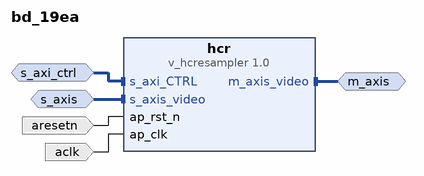
[diagram p0: block diagram of the top level]
# Vivado block design bd_19ea, xc7z020clg484-1, Vivado 2020.1
create_bd_design bd_19ea

create_bd_intf_port -mode Slave -vlnv xilinx.com:interface:aximm_rtl:1.0 s_axi_ctrl
set_property -dict [list \
  CONFIG.PROTOCOL AXI4LITE \
  CONFIG.ADDR_WIDTH 16 \
  CONFIG.SUPPORTS_NARROW_BURST 0 \
  CONFIG.MAX_BURST_LENGTH 1 \
] [get_bd_intf_ports s_axi_ctrl]
create_bd_intf_port -mode Slave -vlnv xilinx.com:interface:axis_rtl:1.0 s_axis
create_bd_intf_port -mode Master -vlnv xilinx.com:interface:axis_rtl:1.0 m_axis
create_bd_port -dir I -type clk aclk
create_bd_port -dir I -type rst aresetn

create_bd_cell -type ip -vlnv xilinx.com:ip:v_hcresampler:1.0 hcr
set_property -dict [list \
  CONFIG.CONVERT_TYPE 0 \
  CONFIG.MAX_COLS 3840 \
  CONFIG.MAX_DATA_WIDTH 8 \
  CONFIG.MAX_ROWS 2160 \
  CONFIG.NUM_H_TAPS 4 \
  CONFIG.SAMPLES_PER_CLOCK 1 \
] [get_bd_cells hcr]

# ---- connections ----

connect_bd_intf_net -intf_net intf_net_hcr_m_axis_video [get_bd_intf_ports m_axis] [get_bd_intf_pins hcr/m_axis_video]
connect_bd_intf_net -intf_net intf_net_bdry_in_s_axi_ctrl [get_bd_intf_ports s_axi_ctrl] [get_bd_intf_pins hcr/s_axi_CTRL]
connect_bd_intf_net -intf_net intf_net_bdry_in_s_axis [get_bd_intf_ports s_axis] [get_bd_intf_pins hcr/s_axis_video]
connect_bd_net -net net_bdry_in_aresetn [get_bd_ports aresetn] [get_bd_pins hcr/ap_rst_n]
connect_bd_net -net net_bdry_in_aclk [get_bd_ports aclk] [get_bd_pins hcr/ap_clk]

# ---- address map ----
assign_bd_address -offset 0x0000 -range 64K -target_address_space [get_bd_addr_spaces s_axi_ctrl] [get_bd_addr_segs hcr/s_axi_CTRL/Reg]

validate_bd_design
save_bd_design
